# EAGLE design Adafruit CAN Pal Breakout (EAGLE 9.6.2)
COMPANY: ADAFRUIT INDUSTRIES; DRAWN: KTOWN; REV: B
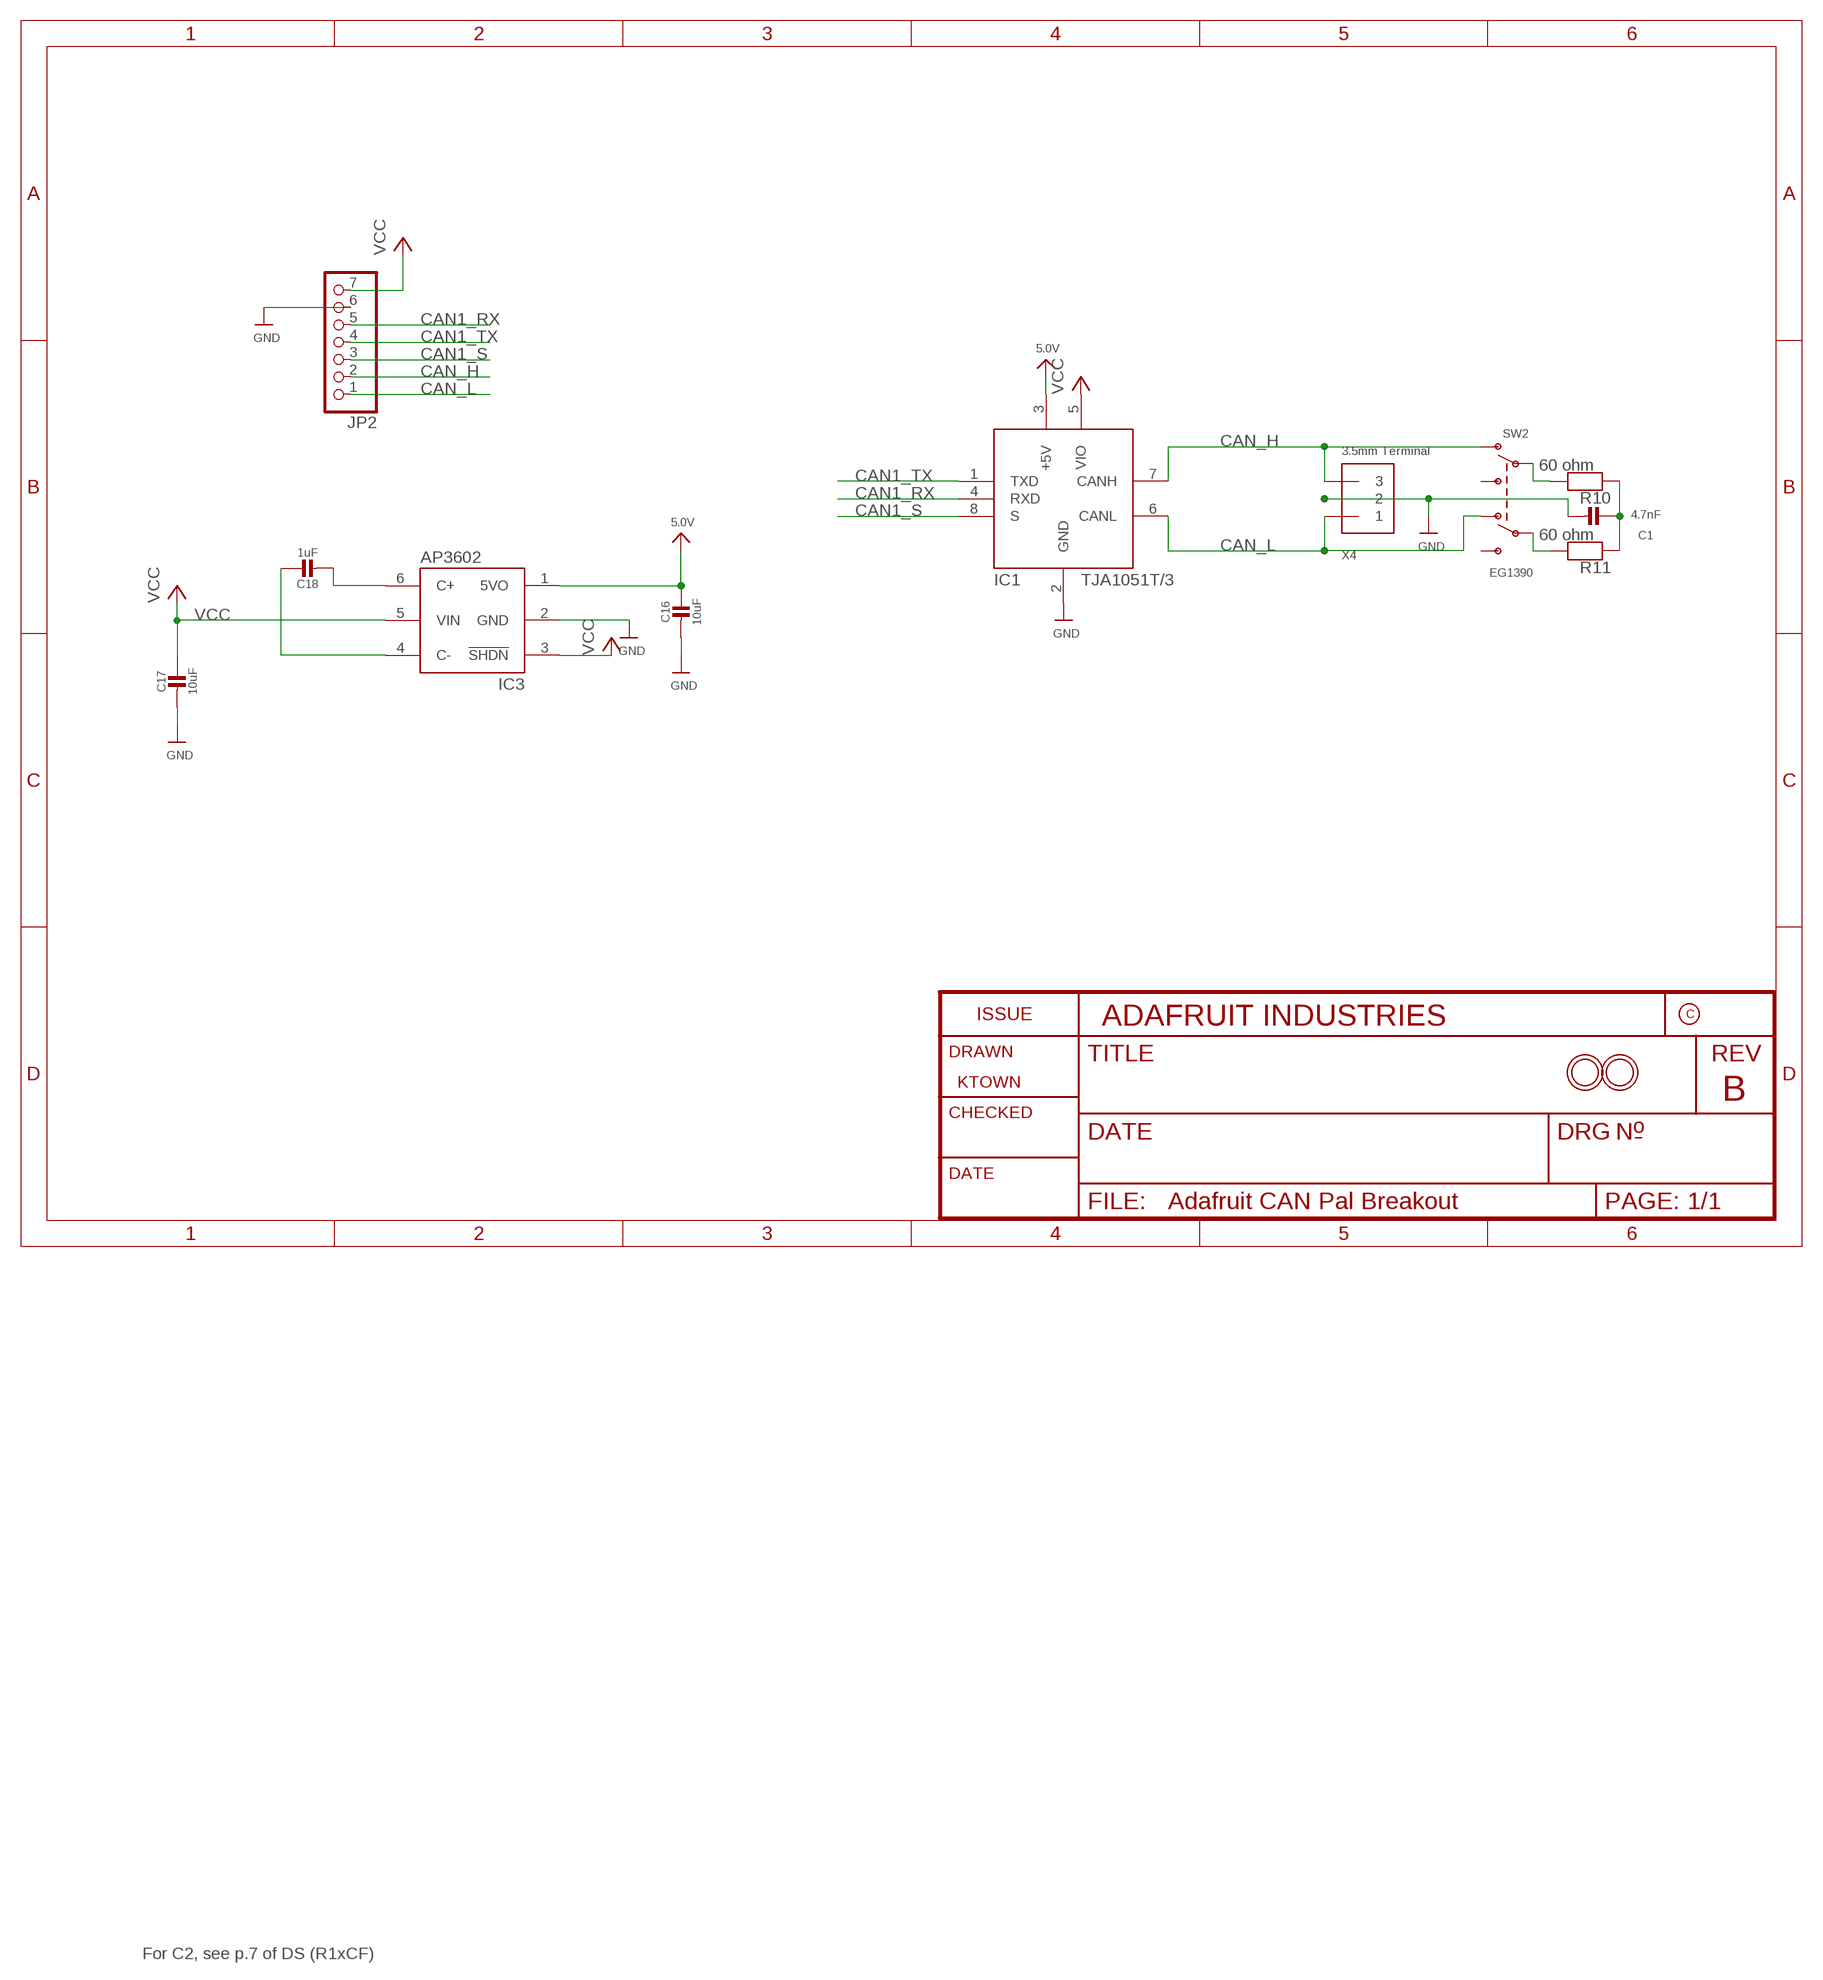
[diagram p0: schematic, sheet 1]

## Parts
C1  4.7nF  CAP_CERAMIC0603_NO  [0603-NO]
C16  10uF  CAP_CERAMIC0805-NOOUTLINE  [0805-NO]
C17  10uF  CAP_CERAMIC0805-NOOUTLINE  [0805-NO]
C18  1uF  CAP_CERAMIC0805_10MGAP  [0805_10MGAP]
IC1  TJA1051T/3  CAN_TRANSCIEVER_TCAN1051V  [SOIC8_150MIL]
IC3  AP3602  [SOT23-6]
JP2  HEADER-1X770MIL  [1X07_ROUND_70]
R10  60 ohm  RESISTOR_0603_NOOUT  [0603-NO]
R11  60 ohm  RESISTOR_0603_NOOUT  [0603-NO]
SW2  EG1390  SWITCH_DPDTEG1390  [EG1390]
U$2  MOUNTINGHOLE2.5  [MOUNTINGHOLE_2.5_PLATED]
U$3  MOUNTINGHOLE2.5  [MOUNTINGHOLE_2.5_PLATED]
X4  3.5mm Terminal  TERMBLOCK_1X3  [TERMBLOCK_1X3-3.5MM]

## Nets
5.0V: C16.1 IC1.3(+5V) IC3.1(5VO)
CAN1_RX: IC1.4(RXD) JP2.5
CAN1_S: IC1.8(S) JP2.3
CAN1_TX: IC1.1(TXD) JP2.4
CAN_H: IC1.7(CANH) JP2.2 SW2.O1 X4.3
CAN_L: IC1.6(CANL) JP2.1 SW2.O2 X4.1
GND [gnd]: C1.2 C16.2 C17.2 IC1.2(GND) IC3.2(GND) JP2.6 X4.2
N$1: R10.2 SW2.P1
N$3: R11.2 SW2.P2
N$8: C18.2 IC3.6(C+)
N$9: C18.1 IC3.4(C-)
N$13: C1.1 R10.1 R11.1
VCC: C17.1 IC1.5(VIO) IC3.3(!SHDN) IC3.5(VIN) JP2.7
Unconnected: SW2.S1 SW2.S2

## Notes on the sheet
- For C2, see p.7 of DS (R1xCF)

## Library data of the parts
C1 C16-C18 = microbuilder:CAP_CERAMIC: Ceramic Capacitors For new designs, use the packages preceded by an '_' character since they are more reliable: The following footprints should be used on most boards: _0402 - Standard footprint for regular board layouts _0603 - Standard footprint for regular board layouts _0805 - Standard footprint for regular board layouts _1206 - Standard footprint for regular board layouts For extremely tight-pitch boards where space is at a premium, the following 'micro-pitch' footprints can be used (smaller pads, no silkscreen outline, etc.): _0402MP - Micro-pitch footprint for very dense/compact boards _0603MP - Micro-pitch footprint for very dense/compact boards _0805MP - Micro-pitch footprint for very dense/compact boards _1206MP - Micro-pitch footprint for very dense/compact boards
IC1 = microbuilder:CAN_TRANSCIEVER
IC3 = microbuilder:AP3602
JP2 = microbuilder:HEADER-1X7: PIN HEADER
R10 R11 = microbuilder:RESISTOR: Resistors For new designs, use the packages preceded by an '_' character since they are more reliable: The following footprints should be used on most boards: _0402 - Standard footprint for regular board layouts _0603 - Standard footprint for regular board layouts _0805 - Standard footprint for regular board layouts _1206 - Standard footprint for regular board layouts For extremely tight-pitch boards where space is at a premium, the following 'micro-pitch' footprints can be used (smaller pads, no silkscreen outline, etc.): _0402MP - Micro-pitch footprint for very dense/compact boards _0603MP - Micro-pitch footprint for very dense/compact boards _0805MP - Micro-pitch footprint for very dense/compact boards _1206MP - Micro-pitch footprint for very dense/compact boards
SW2 = adafruit_electromech:SWITCH_DPDT: Switch - DPDT A DPDT Switch acts like an SPDT switch, but has a pair of switches instead of just one. Vertical - 0.3A @ 6V SMT - Digikey: JS202011SCQN; LCSC: C2837066
U$2 U$3 = adafruit_electromech:MOUNTINGHOLE: Mounting Hole For #2 screws (0.086"/2.18mm width, 0.094"/2.4mm hole) use 2.5mm; BOM: EXCLUDE
X4 = adafruit_electromech:TERMBLOCK_1X3: 3.5mm Terminal block http://www.ladyada.net/library/pcb/eaglelibrary.html

## Net classes
1 power: width 0.254 mm
2 gnd: width 0.254 mm

## Board
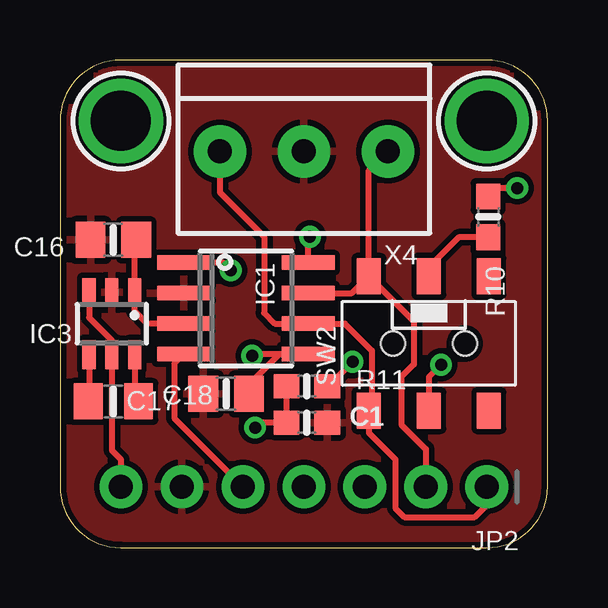
[diagram p1: board, top side]
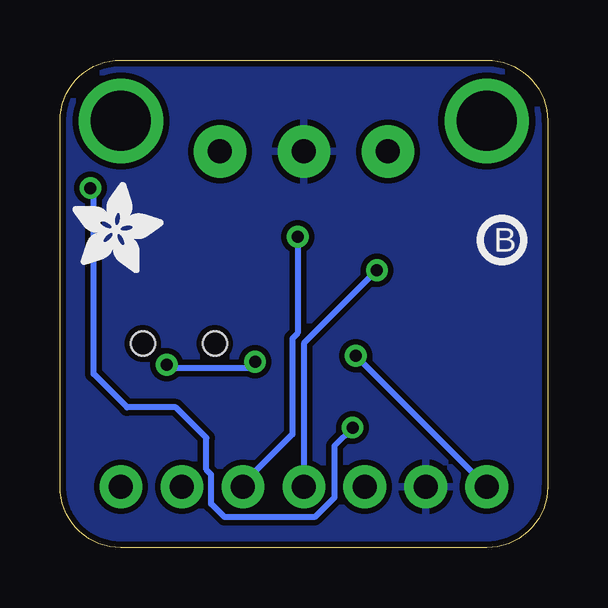
[diagram p2: board, bottom side, seen from below]

Size 20.32 x 20.32 mm. Coordinates in mm from the lower left corner, seen from the top.
Outline: 0,17.78 0,2.54 arc90 2.54,0 17.78,0 arc90 20.32,2.54 20.32,17.78 arc90 17.78,20.32 2.54,20.32 arc90 0,17.78
Copper layers (1*16): Top 0.035mm / dielectric 1.5mm / Bottom 0.035mm
Design rules "adafruit *": minimum track width 8mil, minimum drill 15.5mil, track to track 9mil, track to pad 8mil, pad to pad 8mil, via to via 8mil, smd to smd 8mil, copper to edge 10mil, drill to drill 8mil, minimum pad ring 10mil, minimum via ring 8mil, stop-mask expansion 2mil, vias tented up to drill 20mil, thermal gap 10mil

### Footprints (pad centres in the part's own frame; a part is rotated, then mirrored left to right if it is on the bottom)
0603-NO = smd 1.075 x 1: 1 -0.85,0; 2 0.85,0
0805-NO = smd 1.24 x 1.5: 1 -0.95,0; 2 0.95,0
0805_10MGAP = smd 1.2 x 1.5: 1 -1.05,0; 2 1.05,0
SOIC8_150MIL = smd 0.6 x 2.2: 1 -1.905,-2.6; 2 -0.635,-2.6; 3 0.635,-2.6; 4 1.905,-2.6; 5 1.905,2.6; 6 0.635,2.6; 7 -0.635,2.6; 8 -1.905,2.6
SOT23-6 = smd 0.55 x 1.2: 1 -0.95,-1.3; 2 0,-1.3; 3 0.95,-1.3; 4 0.95,1.3; 5 0,1.3; 6 -0.95,1.3
1X07_ROUND_70 = drill 1 pad 1.778: 1 -7.62,0; 2 -5.08,0; 3 -2.54,0; 4 0,0; 5 2.54,0; 6 5.08,0; 7 7.62,0
EG1390 = smd 1 x 1.5: O1 -2.5,2.8; O2 -2.5,-2.8; P1 0,2.8; P2 0,-2.8; S1 2.5,2.8; S2 2.5,-2.8 | hole 1: 1.5,0; -1.5,0
MOUNTINGHOLE_2.5_PLATED = drill 2.5 pad 3.2: P$1 0,0
TERMBLOCK_1X3-3.5MM = drill 1 pad 2.184: 1 3.5,0; 2 0,0; 3 -3.5,0

### Placement (x,y rotation side)
C1  10.29,5.21 0 top
C16  2.22,12.83 180 top
C17  6.92,6.41 180 top
C18  2.22,6.1 0 top
IC1  7.75,9.97 270 top
IC3  2.16,9.33 180 top
JP2  10.16,2.54 180 top
PLABEL0  [PLABEL0]  2.67,4.19 0 top
PLABEL1  [PLABEL1]  5.08,0.89 0 top
PLABEL2  [PLABEL2]  7.62,4.19 0 top
PLABEL3  [PLABEL3]  10.16,0.89 0 top
PLABEL4  [PLABEL4]  12.83,4.06 0 top
PLABEL5  [PLABEL5]  15.37,0.89 0 top
PLABEL6  [PLABEL6]  18.03,4.19 0 top
PLABEL7  [PLABEL7]  14.61,10.67 90 top
PLABEL8  [PLABEL8]  17.14,10.67 90 top
PLABEL9  [PLABEL9]  15.75,13.84 0 top
PLABEL10  [PLABEL10]  3.3,13.97 0 top
PLABEL11  [PLABEL11]  20.07,5.21 90 top
PLABEL12  [PLABEL12]  10.16,12.7 0 bottom
PLABEL13  [PLABEL13]  10.03,5.59 0 bottom
PLABEL14  [PLABEL14]  6.86,9.14 0 bottom
R10  17.84,13.78 270 top
R11  10.29,6.73 0 top
SW2  15.37,8.51 0 top
U$2  2.54,17.78 0 top
U$3  17.78,17.78 0 top
U$6  [ADAFRUIT_3.5MM]  19.81,11.43 0 bottom
U$7  [PCBFEAT-REV-040]  1.91,12.83 0 bottom
X4  10.16,16.51 180 top

### Tracks (layer width: path | path; a pad name or v marks a point on that pad's centre or on a via)
5.0V
  Top 0.254: C16.1 3.11,12.76 IC3.1 3.11,9.85 3.62,9.34 IC1.3
CAN1_RX
  Top 0.254: IC1.4 4.77,7.68 4.77,5.39 JP2.5
CAN1_S  (via drill 0.5)
  Top 0.254: IC1.8 10.35,12.89 v10.41,12.95
  Bottom 0.254: v10.41,12.95 10.41,8.94 10.64,8.71 10.64,4.72 12.7,2.67 JP2.3
CAN1_TX  (via drill 0.5)
  Top 0.254: v7.11,11.56 6.79,11.87 IC1.1
  Bottom 0.254: v7.11,11.56 10.16,8.51 JP2.4
CAN_H
  Top 0.254: IC1.7 12.16,10.6 SW2.O1 | SW2.O1 12.87,15.72 X4.3 | JP2.2 15.24,4.11 14.22,5.13 14.22,7.11 14.75,7.64 14.75,9.43 SW2.O1
CAN_L
  Top 0.254: JP2.1 17.78,1.78 17.27,1.27 14.35,1.27 13.97,1.65 13.97,3.68 12.87,4.79 SW2.O2 12.99,5.84 12.99,8.21 11.87,9.34 IC1.6 8.95,9.34 8.51,9.78 8.51,12.95 6.66,14.8 X4.1
GND
  pour Bottom: 0,20.32 20.32,20.32 20.32,0 0,0
  pour Top: 0,20.32 20.32,20.32 20.32,0 0,0
N$1
  Top 0.254: R10.2 16.61,12.93 15.37,11.69 SW2.P1
N$3  (via drill 0.5)
  Top 0.254: v12.19,7.75 11.2,6.75 R11.2 | v15.88,7.62 15.37,7.11 SW2.P2
  Bottom 0.254: v15.88,7.62 15.75,7.49 12.45,7.49 v12.19,7.75
N$8
  Top 0.254: IC3.6 3.11,6.26 C18.2
N$9
  Top 0.254: IC3.4 1.21,6.13 C18.1
N$13  (via drill 0.5)
  Top 0.254: R11.1 C1.1 8.33,5.21 v8.13,5.01 | v19.05,14.99 18.2,14.99 R10.1
  Bottom 0.254: v8.13,5.01 8.89,4.25 8.89,2.09 9.71,1.27 13.46,1.27 14.02,1.83 14.02,3.04 14.22,3.25 14.22,4.57 15.49,5.84 17.53,5.84 18.92,7.24 18.92,14.86 v19.05,14.99
VCC  (via drill 0.5)
  Top 0.254: JP2.7 2.54,3.68 2.16,4.06 IC3.5 2.16,8.64 1.21,9.59 IC3.3 | C17.1 7.87,6.79 9.14,8.06 IC1.5 8.06,8.06 v8,8
  Bottom 0.254: v8,8 JP2.7

### Text on the board
Pinguin_tBackup: L | H | ON | OFF | Termination | Vcc | RX | SLNT | CANL | GND | TX | CANH
Pinguin_bBackup: CAN Bus / Transceiver | TJA1051T/3 CAN | 3-5V power/logic w/5V boost / Optional 60 ohm termination